# EAGLE design OPB625_Optical_SW_Breakout (EAGLE 9.3.1)
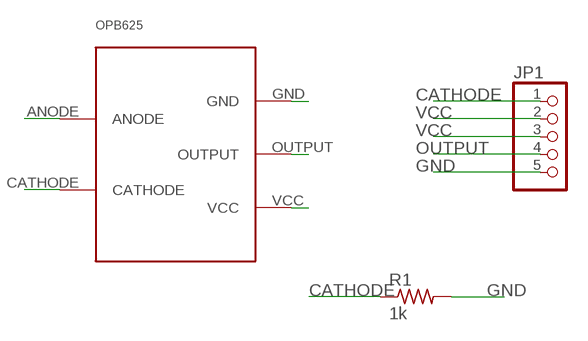
[diagram p0: schematic, sheet 1]

## Parts
JP1  PINHD-1X5  [1X05]
R1  1k  R-US_R0805  [R0805]
U$1  OPB625  [OPB625]

## Nets
CATHODE: JP1.1 R1.1 U$1.CATHODE
GND: JP1.5 R1.2 U$1.GND
OUTPUT: JP1.4 U$1.OUTPUT
VCC: JP1.2 JP1.3 U$1.ANODE U$1.VCC

## Library data of the parts
JP1 = pinhead:PINHD-1X5: PIN HEADER
R1 = resistor:R-US_: RESISTOR, American symbol
U$1 = MAE_Lib:OPB625

## Board
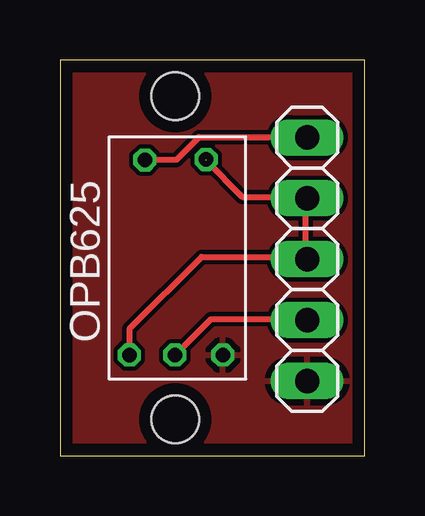
[diagram p1: board, top side]
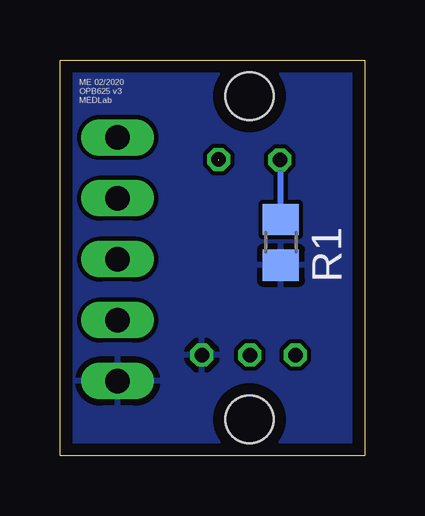
[diagram p2: board, bottom side, seen from below]

Size 12.7 x 16.51 mm. Coordinates in mm from the lower left corner, seen from the top.
Outline: 0,0 12.7,0 12.7,16.51 0,16.51 0,0
Copper layers (1*16): Top 0.035mm / dielectric 1.5mm / Bottom 0.035mm
Design rules "PCBWay": minimum track width 7mil, minimum drill 8mil, track to track 7mil, track to pad 7mil, pad to pad 7mil, via to via 7mil, smd to smd 7mil, copper to edge 20mil, drill to drill 8mil, minimum pad ring 7mil, minimum via ring 6mil, stop-mask expansion 4mil, vias tented up to drill 0mil, thermal gap 10mil
Holes 2 mm at 4.8,15 4.8,1.52

### Footprints (pad centres in the part's own frame; a part is rotated, then mirrored left to right if it is on the bottom)
1X05 = drill 1.016 long: 1 -5.08,0; 2 -2.54,0; 3 0,0; 4 2.54,0; 5 5.08,0
R0805 = smd 1.3 x 1.5: 1 -0.95,0; 2 0.95,0
OPB625 = drill 0.6 octagon: ANODE 0.84,3.95; CATHODE 0.86,1.4; GND 9,4.65; OUTPUT 9,2.65; VCC 9,0.75

### Placement (x,y rotation side)
JP1  10.3,8.2 270 top
R1  3.5,8.9 270 bottom
U$1  2.14,13.2 270 top

### Tracks (layer width: path | path; a pad name or v marks a point on that pad's centre or on a via)
CATHODE
  Top 0.254: U$1.CATHODE 4.84,12.34 5.8,13.3 10.28,13.3 JP1.1
  Bottom 0.254: R1.1 3.5,12.3 U$1.CATHODE
GND
  pour Bottom: -0.2,16.8 13.2,16.8 13.3,16.7 13.3,0.2 12.8,-0.3 -0.3,-0.3 -0.6,0 -0.6,16.3 -0.6,16.4
  pour Top: -0.3,17 12.9,17 13.5,16.4 13.5,-0.2 12.8,-0.9 0.2,-0.9 -0.9,0.2 -0.9,16.4
OUTPUT
  Top 0.254: U$1.OUTPUT 6.3,5.7 10.26,5.7 JP1.4
VCC  (1 unrouted)
  Top 0.254: U$1.VCC 2.89,5.29 5.9,8.3 10.2,8.3 JP1.3 10.24,8.26 10.24,10.8 | 10.24,10.8 JP1.2 | 6.09,12.31 7.6,10.8 10.24,10.8

### Text on the board
bNames: ME 02/2020 / OPB625 v3 / MEDLab